# Altium project BigBossBoard.PrjPcb
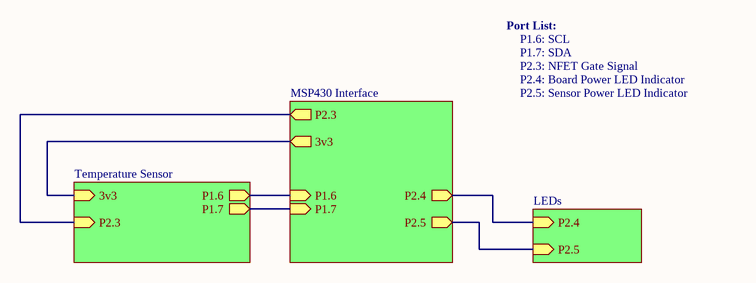
[diagram p0: SystemView.SchDoc]
4 sheets, 9 parts. Net scope: hierarchical (ports join the sheet entries above them; power ports are global).
Board file: BBB.PcbDoc
Sheets:
  SystemView.SchDoc
    MSP430 Interface = LaunchPadHeader.SchDoc
    Temperature Sensor = TempSensor.SchDoc
    LEDs = StatusLEDs.SchDoc

## Sheet SystemView.SchDoc
size A; SheetNumber: 1; SheetTotal: 3

### Sub-sheets
LEDs = StatusLEDs.SchDoc: P2.5 (in), P2.4 (in)
MSP430 Interface = LaunchPadHeader.SchDoc: 3v3 (out), P2.4 (out), P2.3 (out), P2.5 (out), P1.6 (in), P1.7 (in)
Temperature Sensor = TempSensor.SchDoc: P1.7 (out), P1.6 (out), 3v3 (in), P2.3 (in)

### Nets
LED_SENSE1: sheet MSP430 Interface/P2.5, sheet LEDs/P2.5
LED_VCC1: sheet MSP430 Interface/P2.4, sheet LEDs/P2.4
NFET_GATE1: sheet MSP430 Interface/P2.3, sheet Temperature Sensor/P2.3
SCL: sheet MSP430 Interface/P1.6, sheet Temperature Sensor/P1.6
SDA: sheet MSP430 Interface/P1.7, sheet Temperature Sensor/P1.7
VCC: sheet MSP430 Interface/3v3, sheet Temperature Sensor/3v3

### Notes on the sheet
- Port List:
- P1.6: SCL
- P1.7: SDA
- P2.3: NFET Gate Signal
- P2.4: Board Power LED Indicator
- P2.5: Sensor Power LED Indicator

## Sheet LaunchPadHeader.SchDoc
size A; SheetNumber: 2; SheetTotal: 4
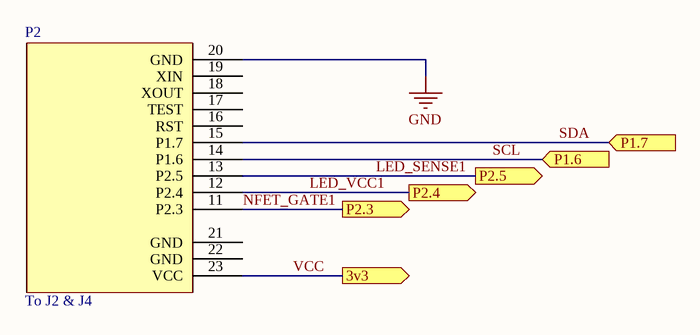
[diagram p1: LaunchPadHeader.SchDoc]

### Parts
P2  To J2 & J4  [MSP-EXP430G2 Mating Headers for J2/J4]

### Ports
3v3 (out), P1.6 (in), P1.7 (in), P2.3 (out), P2.4 (out), P2.5 (out)

### Nets
GND: P2.20(GND)
LED_SENSE1: P2.13(P2.5) ; port P2.5
LED_VCC1: P2.12(P2.4) ; port P2.4
NFET_GATE1: P2.11(P2.3) ; port P2.3
SCL: P2.14(P1.6) ; port P1.6
SDA: P2.15(P1.7) ; port P1.7
VCC: P2.23(VCC) ; port 3v3

Not connected (* = marked no-connect by the designer): P2 16(RST) 17(TEST) 18(XOUT) 19(XIN) 21(GND) 22(GND)

### Library data of the parts
P2 = MSP-EXP430G2 Mating Headers for J2/J4: Female Mating Headers for MSP-EXP430G2 J2 & J4 (can use Wurth Elektronik 61301011121 and 61300311121); Manufacturer: URC; Manufacturer Part Number: N/A; Value: N/A

## Sheet TempSensor.SchDoc
size A; SheetNumber: 3; SheetTotal: 4
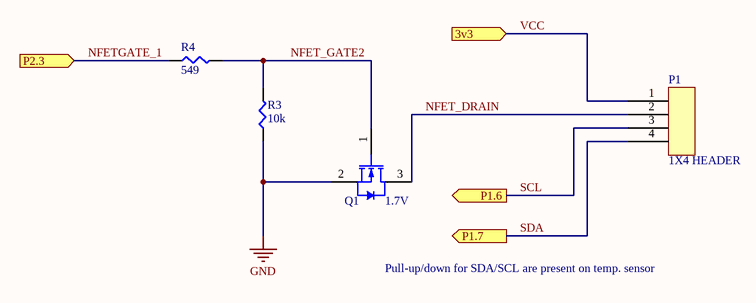
[diagram p2: TempSensor.SchDoc]

### Parts
P1  1X4 HEADER  [1X4 HEADER]
Q1  1.7V  [FAIR-SOT3-3_V]
R3  10k  [SMD-0805-RES]
R4  549  [SMD-0805-RES]

### Ports
3v3 (in), P1.6 (out), P1.7 (out), P2.3 (in)

### Nets
GND: Q1.2(S) R3.1
NFET_DRAIN: P1.2 Q1.3(D)
NFET_GATE2: Q1.1(G) R3.2 R4.2
NFETGATE_1: R4.1 ; port P2.3  [project net NFET_GATE1]
SCL: P1.3 ; port P1.6
SDA: P1.4 ; port P1.7
VCC: P1.1 ; port 3v3

### Notes on the sheet
- Pull-up/down for SDA/SCL are present on temp. sensor

### Library data of the parts
P1 = 1X4 HEADER: CONN HEADER VERT 4POS 2.54MM; Manufacturer: Würth Elektronik; Manufacturer Part Number: 61300411121; Value: 1x4 Header
Q1 = CMP-2000-04934-1: N-Channel Logic Level Enhancement Mode Field Effect Transistor, 1.7V, -55 to 150 degC, 3-Pin SOT-23, RoHS, Tape and Reel; Manufacturer: Fairchild; Manufacturer Part Number: BSS123; Value: 1.7 V
R3 = ERJ-6ENF1002V: RES SMD 10k OHM 1% 1/8W 0805; Manufacturer: Panasonic Electronic Components; Manufacturer Part Number: ERJ-P06F1002V; Value: 10k
R4 = ERJ-6ENF5490V: RES SMD 549 OHM 1% 1/8W 0805; Manufacturer: Panasonic Electronic Components; Value: 549; Manufacturer Part Number: ERJ-6ENF5490V

## Sheet StatusLEDs.SchDoc
size A; SheetNumber: 4; SheetTotal: 4
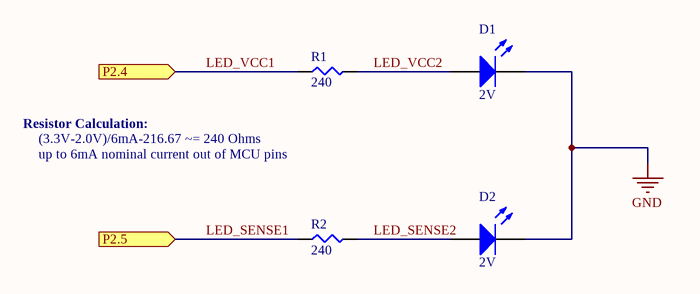
[diagram p3: StatusLEDs.SchDoc]

### Parts
D1  2V  [0805_A]
D2  2V  [0805_A]
R1  240  [SMD-0805-RES]
R2  240  [SMD-0805-RES]

### Ports
P2.4 (in), P2.5 (in)

### Nets
GND: D1.1(K) D2.1(K)
LED_SENSE1: R2.1 ; port P2.5
LED_SENSE2: D2.2(A) R2.2
LED_VCC1: R1.1 ; port P2.4
LED_VCC2: D1.2(A) R1.2

### Notes on the sheet
- Resistor Calculation:
- (3.3V-2.0V)/6mA-216.67 ~= 240 Ohms
- up to 6mA nominal current out of MCU pins

### Library data of the parts
D1 D2 = CMP-1426-00009-1: SMD mono-color Chip LED, WL-SMCW, Bright Green; Manufacturer: Wuerth Elektronik; Manufacturer Part Number: 150080VS75000; Value: 2V
R1 R2 = ERJ-6ENF2400V: RES SMD 240 OHM 1% 1/8W 0805; Manufacturer: Panasonic Electronic Components; Value: 240; Manufacturer Part Number: ERJ-6ENF2400V

## Nets that join several sheets
GND: LaunchPadHeader (P2.20), TempSensor (Q1.2 R3.1), StatusLEDs (D1.1 D2.1)
LED_SENSE1: LaunchPadHeader (P2.13), StatusLEDs (R2.1)
LED_VCC1: LaunchPadHeader (P2.12), StatusLEDs (R1.1)
NFET_GATE1: LaunchPadHeader (P2.11), TempSensor (R4.1)
SCL: LaunchPadHeader (P2.14), TempSensor (P1.3)
SDA: LaunchPadHeader (P2.15), TempSensor (P1.4)
VCC: LaunchPadHeader (P2.23), TempSensor (P1.1)